# Altium schematic sheet 04_WIFI_BLE_ANTENNA.SchDoc: WIFI/BLE Antenna
size 297 x 209 mm; Author: T. Ludemann; SheetNumber: 3; SheetTotal: 5; DocSize: DINA4
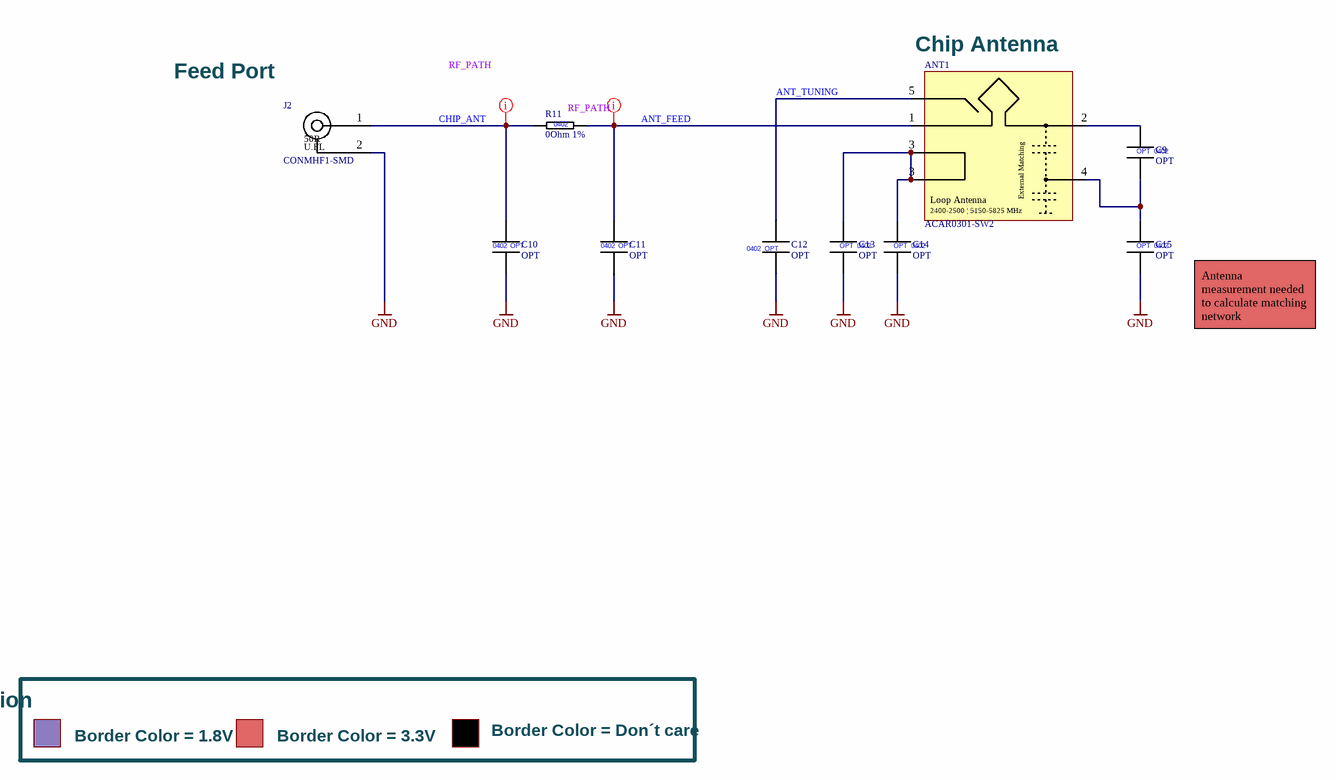
[diagram p0: 04_WIFI_BLE_ANTENNA.SchDoc]

## Parts
?  (no value)  (graphical)
ANT1  ACAR0301-SW2  [ANTENNA_ACAR0301-SW2_FEED_LEFT]
C9  OPT  [CAPC1005X06L]  (no BOM)
C10  OPT  [CAPC1005X06L]  (no BOM)
C11  OPT  [CAPC1005X06L]  (no BOM)
C12  OPT  [CAPC1005X06L]  (no BOM)
C13  OPT  [CAPC1005X06L]  (no BOM)
C14  OPT  [CAPC1005X06L]  (no BOM)
C15  OPT  [CAPC1005X06L]  (no BOM)
J2  CONMHF1-SMD  [U.FL Jack SMD]  (no BOM)
R11  0Ohm 1%  [RESC1005X04L]

## Nets
GND: C10.2 C11.2 C12.1 C13.2 C14.2 C15.2 J2.2
ANT_FEED: ANT1.1 C11.1 R11.2
ANT_TUNING: ANT1.5 C12.2
CHIP_ANT: C10.1 J2.1 R11.1
NetANT1_2: ANT1.2 C9.1
NetANT1_3: ANT1.3 C13.1 C14.1
NetANT1_4: ANT1.4 C9.2 C15.1

## Layout directives
net class RF_PATH: ANT_FEED, CHIP_ANT

## Notes on the sheet
- (near J2) Feed Port
- (near ANT1) Chip Antenna
- Antenna measurement needed to calculate matching network
- Signal Level Indication
- Border Color = 1.8V
- Border Color = 3.3V
- Border Color = Don´t care
- OV Tech GmbH - Open Visions Technology
- (in symbol CAP_0402_OPT) 0402
- (in symbol Chip Antenna_ACAR0301-SW2) External Matching; Loop Antenna; 2400-2500 | 5150-5825 MHz
- (in symbol RES_0402_0R_1%) 0402
- (in symbol U.FL_CONMHF1-SMD) 50R; U.FL

## Library data of the parts
? = Titleblock_01_OpenSource
ANT1 = Chip Antenna_ACAR0301-SW2: Ceramic Chip Antenna ACAR0301-SW2 2.4 - 5.825GHZ; Manufacturer 1: ABRACON; Manufacturer 1 Prt. Nr.: ACAR0301-SW2
C9-C15 = CAP_0402_OPT: Optional Capacitor 0402
J2 = U.FL_CONMHF1-SMD: U.FL Type Jack PCB SMD RF Connector; Manufacturer 1: Linx Technologies; Manufacturer 1 Prt. Nr.: CONMHF1-SMD
R11 = RES_0402_0R_1%: Thick Film Resistors - SMD 0OHM 1%; Manufacturer 1: Bourns; Manufacturer 1 Prt. Nr.: CR0402AJ/-000GAS; Manufacturer 2 Prt. Nr.: AC0402FR-070RL; Manufacturer 2: YAGEO